# Altium schematic sheet Sheet1.SchDoc: Capacitive Sensor Board
size A4; DrawnBy: Coen de Boer; Engineer: Coen de Boer; Revision: 2015-H
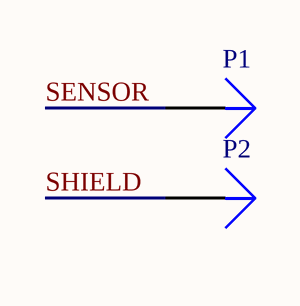
[diagram p0: Sheet1.SchDoc]

## Parts
P1  (no value)  [AVX POKE HOME CONTACT 1.7MM]
P2  (no value)  [AVX POKE HOME CONTACT 1.7MM]

## Nets
SENSOR: P1.1
SHIELD: P2.1

## Notes on the sheet
- Title
- Size:
- Date:
- A4
- Number:
- Time:
- Revision:
- Sheet
- of
- File:

## Library data of the parts
P1 P2 = Plug: Mfg: AVX; Mfg code: 70-9296-001-017-006; LatestRevisionDate: 17-Jul-2002; LatestRevisionNote: Re-released for DXP Platform.; Publisher: Altium Limited